# Altium schematic sheet 贴锁控制板201105.SchDoc
size A2
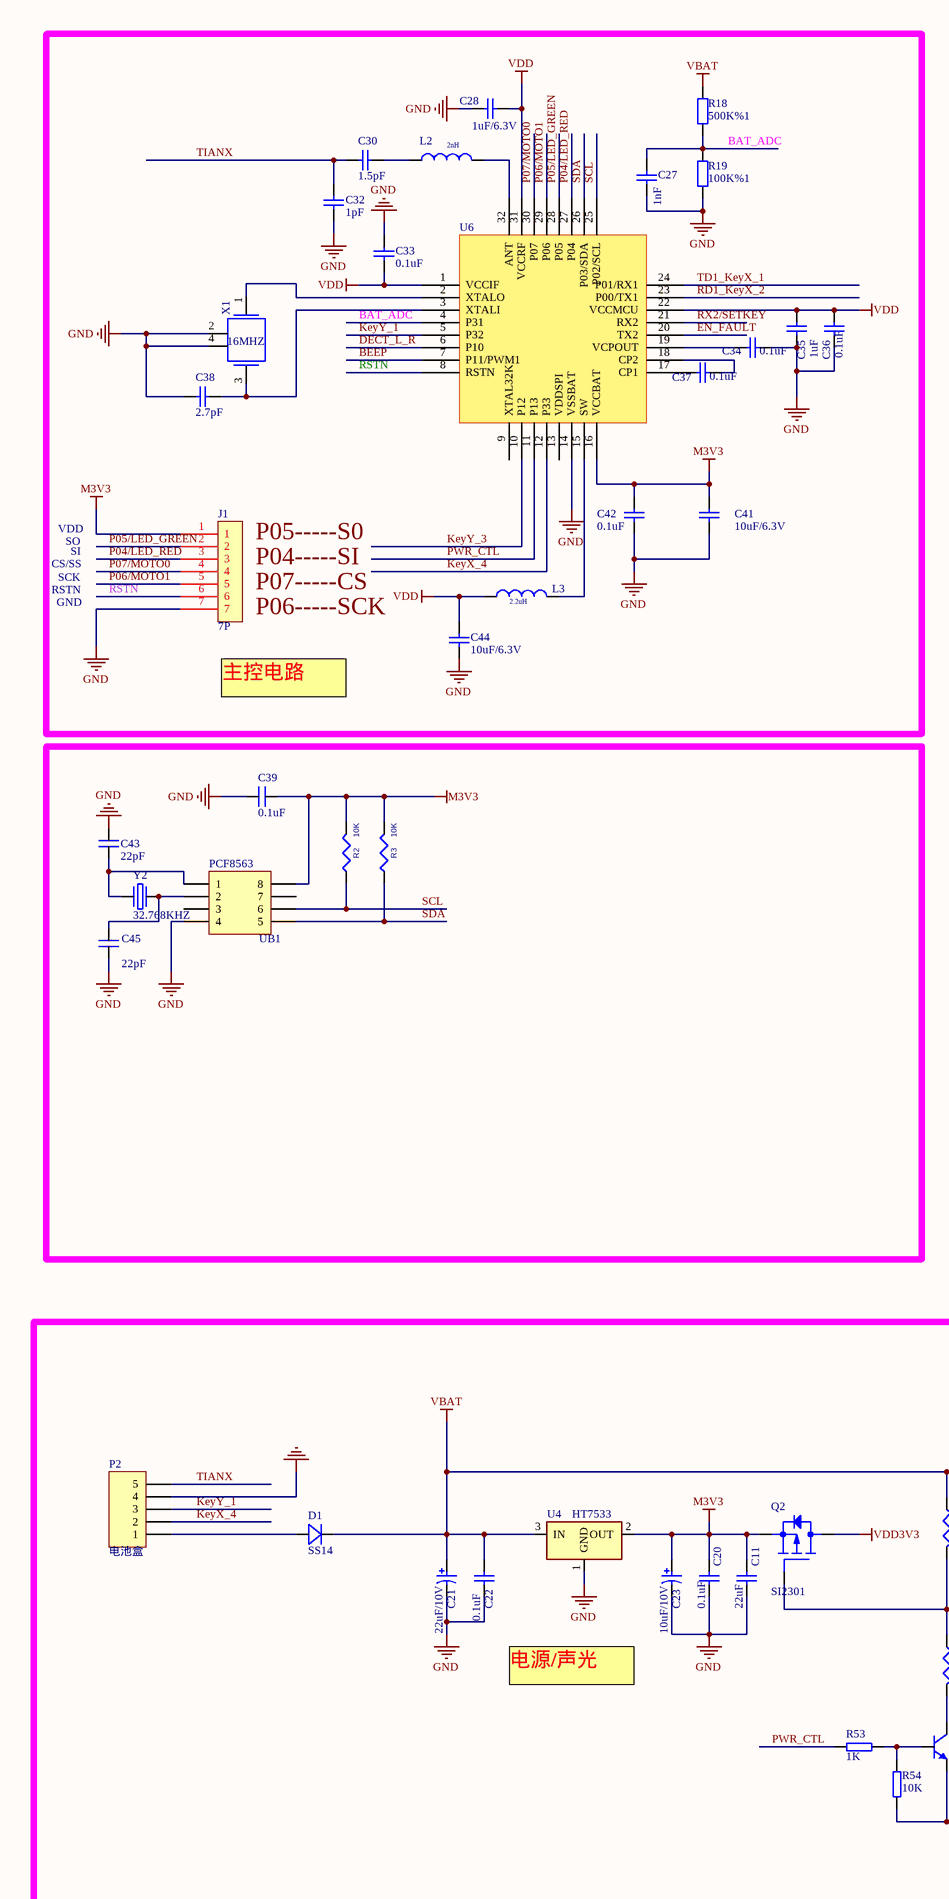
[diagram p0: 贴锁控制板201105.SchDoc, left]
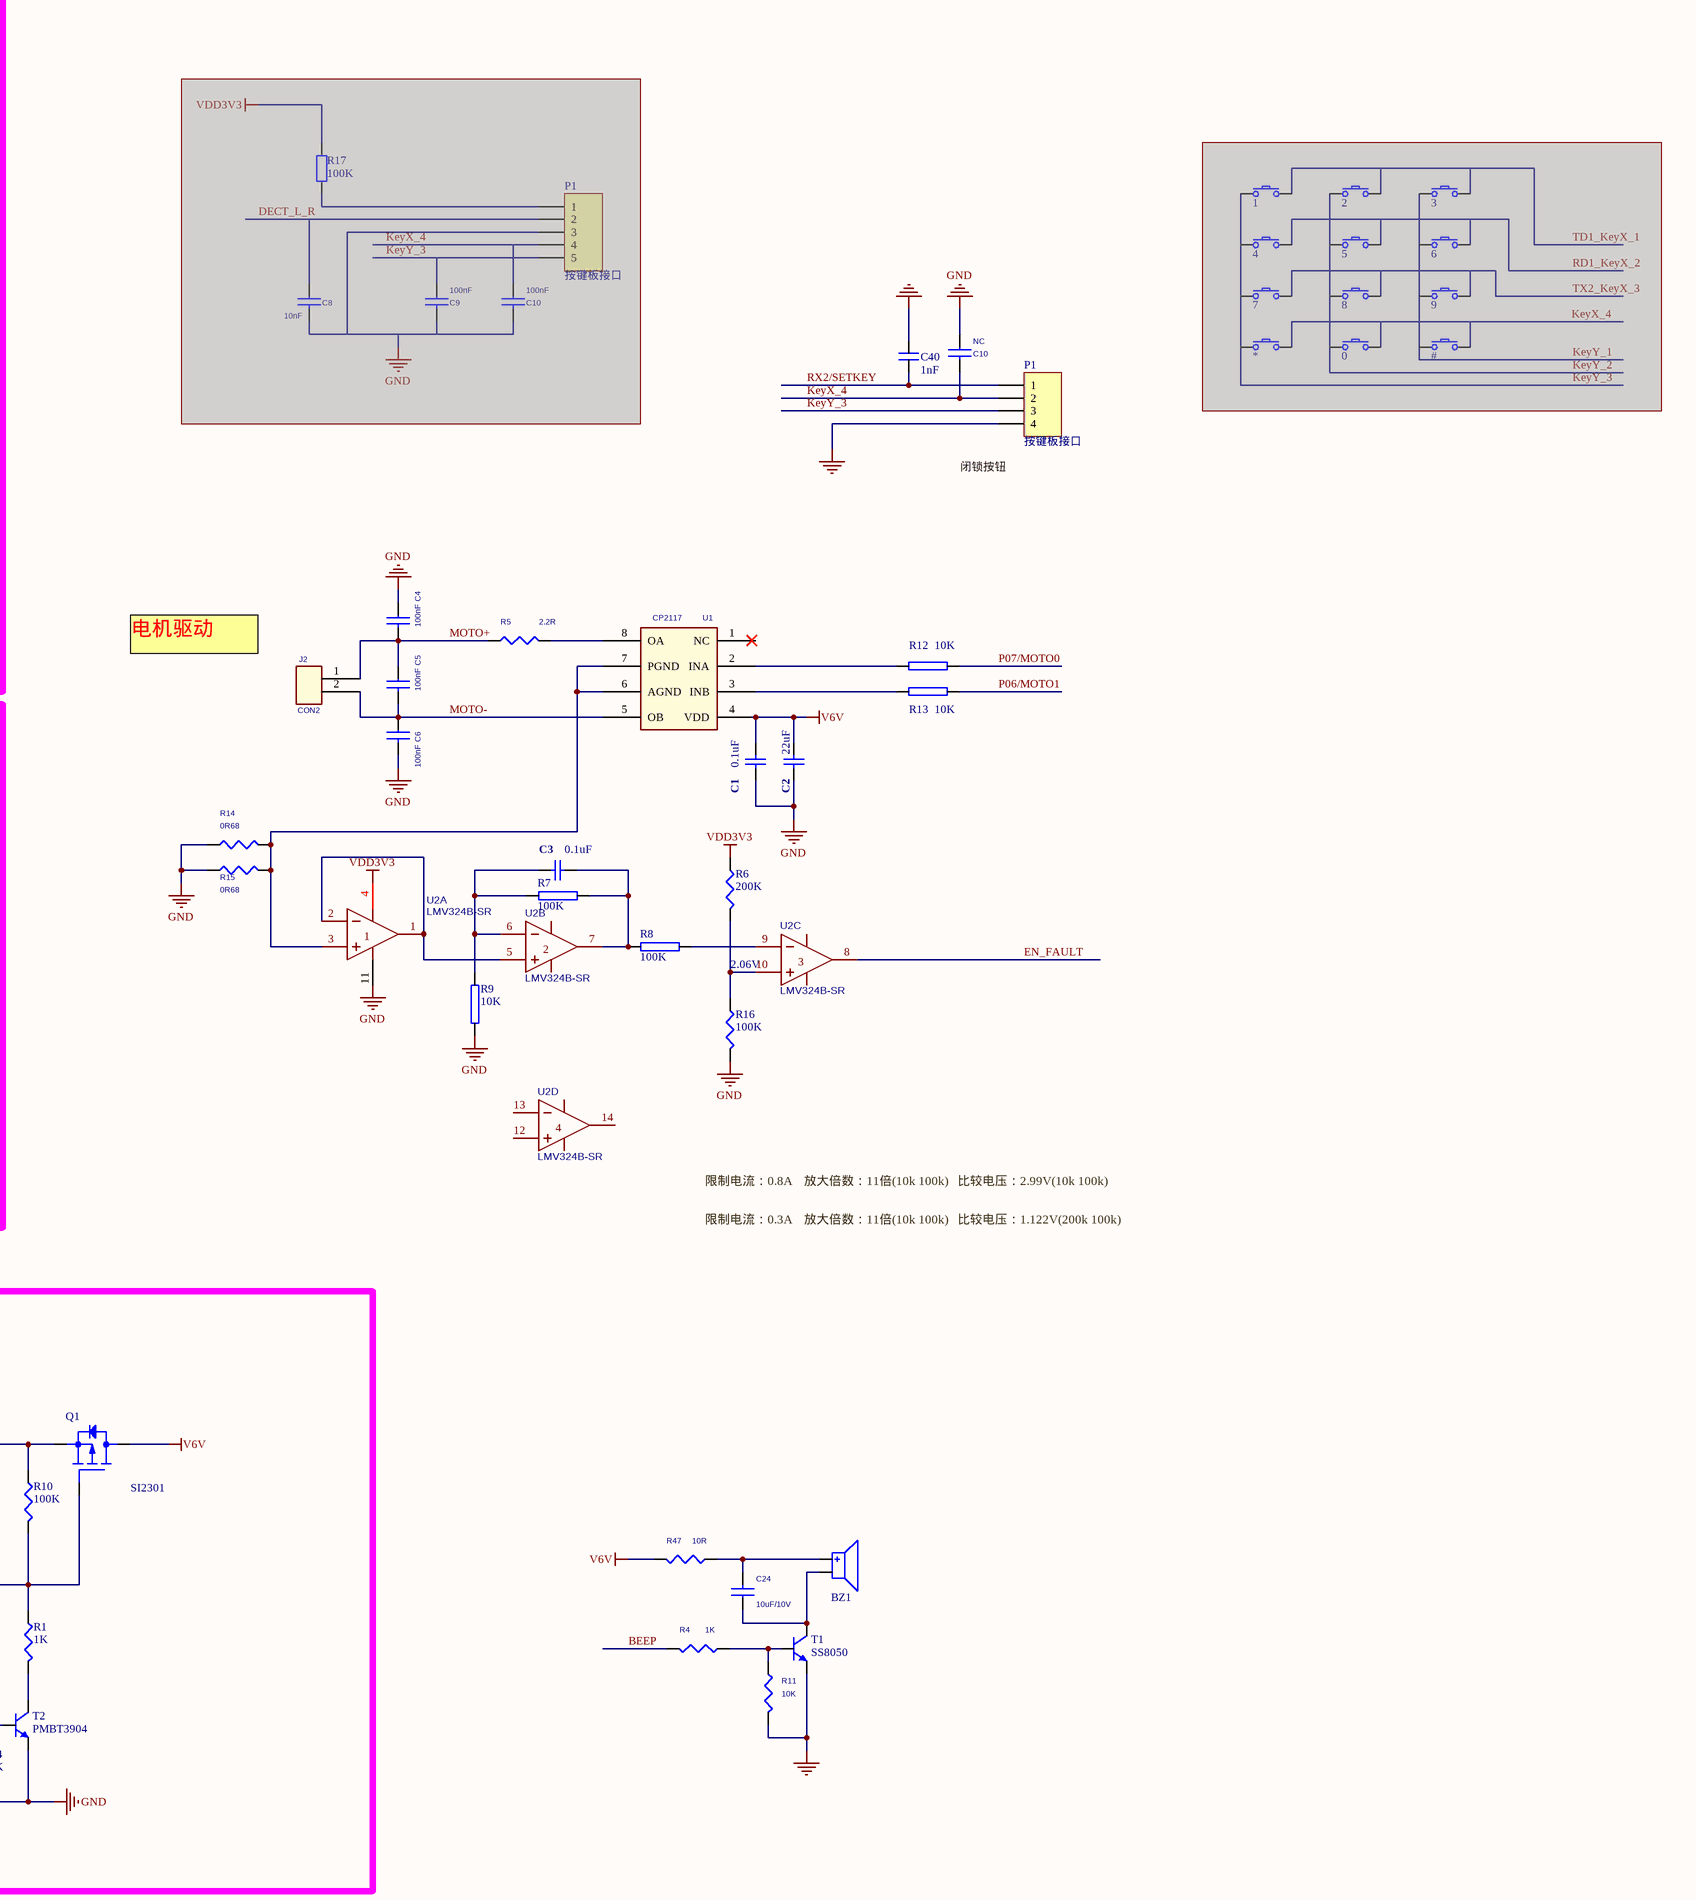
[diagram p1: 贴锁控制板201105.SchDoc, right]

## Parts
(Parts that share a designator on the sheet are numbered #1, #2 ... from top to bottom, then left to right.)
0  SW  [KEY_5.2*3.7*6.4]  (value not drawn)  (masked out: inside a compile mask, not in the netlist)
1  SW  [KEY_5.2*3.7*6.4]  (value not drawn)  (masked out: inside a compile mask, not in the netlist)
2  SW  [KEY_5.2*3.7*6.4]  (value not drawn)  (masked out: inside a compile mask, not in the netlist)
3  SW  [KEY_5.2*3.7*6.4]  (value not drawn)  (masked out: inside a compile mask, not in the netlist)
4  SW  [KEY_5.2*3.7*6.4]  (value not drawn)  (masked out: inside a compile mask, not in the netlist)
5  SW  [KEY_5.2*3.7*6.4]  (value not drawn)  (masked out: inside a compile mask, not in the netlist)
6  SW  [KEY_5.2*3.7*6.4]  (value not drawn)  (masked out: inside a compile mask, not in the netlist)
7  SW  [KEY_5.2*3.7*6.4]  (value not drawn)  (masked out: inside a compile mask, not in the netlist)
8  SW  [KEY_5.2*3.7*6.4]  (value not drawn)  (masked out: inside a compile mask, not in the netlist)
9  SW  [KEY_5.2*3.7*6.4]  (value not drawn)  (masked out: inside a compile mask, not in the netlist)
#  SW  [KEY_5.2*3.7*6.4]  (value not drawn)  (masked out: inside a compile mask, not in the netlist)
*  SW  [KEY_5.2*3.7*6.4]  (value not drawn)  (masked out: inside a compile mask, not in the netlist)
BZ1  BUZZER  [BUZZER_9*9*1.8]  (value not drawn)
C1  0.1uF  [0603C]
C2  22uF  [LC-0805_C]
C3  0.1uF  [0603C]
C4  100nF  [0603C]
C5  100nF  [0603C]
C6  100nF  [0603C]
C8  10nF  [0603C]  (masked out: inside a compile mask, not in the netlist)
C9  100nF  [0603C]  (masked out: inside a compile mask, not in the netlist)
C10#1  100nF  [0603C]  (masked out: inside a compile mask, not in the netlist)
C10#2  NC  [0603C]
C11  22uF  [LC-0805_C]
C20  0.1uF  [0603C]
C21  22uF/10V  [LC-0805_C]
C22  0.1uF  [0603C]
C23  10uF/10V  [LC-0805_C]
C24  10uF/10V  [0603C]
C27  1nF  [0603C]
C28  1uF/6.3V  [0603C]
C30  1.5pF  [0603C]
C32  1pF  [0603C]
C33  0.1uF  [0603C]
C34  0.1uF  [0603C]
C35  1uF  [0603C]
C36  0.1uF  [0603C]
C37  0.1uF  [0603C]
C38  2.7pF  [0603C]
C39  0.1uF  [0603C]
C40  1nF  [0603C]
C41  10uF/6.3V  [0603C]
C42  0.1uF  [0603C]
C43  22pF  [0603C]
C44  10uF/6.3V  [0603C]
C45  22pF  [0603C]
D1  SS14  [DO-214AA]
J1  7P  [7P-2.0MM - duplicate]
J2  CON2  [2PH-2.0]
L2  2nH  [0603L]
L3  2.2uH  [0603L]
P1#1  按键板接口  [TH_5P-P1.25]  (masked out: inside a compile mask, not in the netlist)
P1#2  按键板接口  [B4B-PH]
P2  电池盒  [B5B-PH]
Q1  SI2301  [SOT-23 - GDS]
Q2  SI2301  [SOT-23 - GDS]
R1  1K  [LC-0603_R]
R2  10K  [LC-0603_R]
R3  10K  [LC-0603_R]
R4  1K  [LC-0603_R]
R5  2.2R  [0805_R]
R6  200K  [LC-0603_R]
R7  100K  [LC-0603_R]
R8  100K  [LC-0603_R]
R9  10K  [LC-0603_R]
R10  100K  [LC-0603_R]
R11  10K  [LC-0603_R]
R12  10K  [LC-0603_R]
R13  10K  [LC-0603_R]
R14  0R68  [LC-0603_R]
R15  0R68  [LC-0603_R]
R16  100K  [LC-0603_R]
R17  100K  [LC-0603_R]  (masked out: inside a compile mask, not in the netlist)
R18  500K%1  [LC-0603_R]
R19  100K%1  [LC-0603_R]
R47  10R  [LC-0603_R]
R53  1K  [LC-0603_R]
R54  10K  [LC-0603_R]
T1  SS8050  [SOT-23-3L]
T2  PMBT3904  [SOT-23-3L]
U1  CP2117  [SOP8]
U2  LMV324B-SR  [SOIC-14_L8.7-W3.9-P1.27-LS6.0-BL]  (parts A,B,C,D of 4)
U4  HT7533  [SOT-23-3L]
U6  BK3431Q  [QFN32_4*4*0.4]  (value not drawn)
UB1  PCF8563  [SOP8]
X1  16MHZ  [XTAL3225]
Y2  32.768KHZ  [晶振-9]

## Nets
GND: C1.2 C2.2 C4.1 C6.2 C10#2.1 C11.2 C20.2 C21.2 C22.2 C23.2 C27.1 C28.1 C32.1 C33.1 C34.2 C35.1 C36.1 C38.1 C39.2 C40.2 C41.2 C42.2 C43.2 C44.1 C45.1 J1.7 P1#2.4 P2.4 R9.2 R11.2 R14.1 R15.1 R16.2 R19.2 R54.1 T1.2 T2.2 U2.11(-VS) U4.1(GND) U6.14(VSSBAT) UB1.4 X1.2 X1.4
M3V3: C11.1 C20.1 C23.1 C39.1 C41.1 C42.1 J1.1 Q2.S(SOURCE) R2.1 R3.1 U4.2(OUT) U6.16(VCCBAT) UB1.8
V6V: C1.1 C2.1 Q1.D(DRAIN) R47.2 U1.4(VDD)
VBAT: C21.1 C22.1 D1.2(K) Q1.S(SOURCE) R10.1 R18.1 U4.3(IN)
VDD: C28.2 C33.2 C35.2 C36.2 C44.2 L3.1(P1) U6.1(VCCIF) U6.22(VCCMCU) U6.31(VCCRF)
VDD3V3: Q2.D(DRAIN) R6.1 U2.4(+VS)
BAT_ADC: C27.2 R18.2 R19.1 U6.4(P31)
BEEP: R4.2 U6.7(P11/PWM1)
DECT_L_R: U6.6(P10)
EN_FAULT: U2.8(OUTC) U6.20(TX2)
KeyX_4: C10#2.2 P1#2.2 P2.2 U6.12(P33)
KeyY_1: P2.3 U6.5(P32)
KeyY_3: P1#2.3 U6.10(P12)
MOTO+: C4.2 C5.1 J2.1 R5.1
MOTO-: C5.2 C6.1 J2.2 U1.5(OB)
P04/LED_RED: J1.3 U6.27(P04)
P05/LED_GREEN: J1.2 U6.28(P05)
P06/MOTO1: J1.5 R13.1 U6.29(P06)
P07/MOTO0: J1.4 R12.1 U6.30(P07)
PWR_CTL: R53.1 U6.11(P13)
RD1_KeyX_2: U6.23(P00/TX1)
RSTN: J1.6 U6.8(RSTN)
RX2/SETKEY: C40.1 P1#2.1 U6.21(RX2)
SCL: R2.2 U6.25(P02/SCL) UB1.6
SDA: R3.2 U6.26(P03/SDA) UB1.5
TD1_KeyX_1: U6.24(P01/RX1)
TIANX: C30.2 C32.2 P2.5
NetBZ1_1: BZ1.1 C24.2 R47.1
NetBZ1_2: BZ1.2 C24.1 T1.3
NetC3_1: C3.1 R7.2 R9.1 U2.6(INB-)
NetC3_2: C3.2 R7.1 R8.1 U2.7(OUTB)
NetC30_1: C30.1 L2.1(P1)
NetC34_1: C34.1 U6.19(VCPOUT)
NetC37_1: C37.1 U6.17(CP1)
NetC37_2: C37.2 U6.18(CP2)
NetC38_2: C38.2 U6.3(XTALI) X1.3
NetC43_1: C43.1 UB1.1 Y2.1
NetC45_2: C45.2 UB1.2 Y2.2
NetD1_1: D1.1(A) P2.1
NetL2_2: L2.2(P2) U6.32(ANT)
NetL3_2: L3.2(P2) U6.15(SW)
NetQ1_G: Q1.G(GATE) Q2.G(GATE) R1.1 R10.2
NetR1_2: R1.2 T2.3
NetR4_1: R4.1 R11.1 T1.1
NetR5_2: R5.2 U1.8(OA)
NetR6_2: R6.2 R16.1 U2.10(INC+)
NetR8_2: R8.2 U2.9(INC-)
NetR12_2: R12.2 U1.2(INA)
NetR13_2: R13.2 U1.3(INB)
NetR14_2: R14.2 R15.2 U1.6(AGND) U1.7(PGND) U2.3(INA+)
NetR53_2: R53.2 R54.2 T2.1
NetU2_1: U2.1(OUTA) U2.2(INA-) U2.5(INB+)
NetU6_2: U6.2(XTALO) X1.1

Not connected (* = marked no-connect by the designer): U1 1(NC); U2 12(IND+) 13(IND-) 14(OUTD); U6 9(XTAL32K) 13(VDDSPI); UB1 3 7

## Notes on the sheet
- VDD
- 闭锁按钮
- RSTN
- CS/SS
- SCK
- SO
- SI
- (near J1) P04-----SI
- (near J1) P05-----S0
- (near J1) P07-----CS
- GND
- (near J1) P06-----SCK
- 主控电路
- 电机驱动
- (near U2) 2.06V
- 限制电流：0.8A    放大倍数：11倍(10k 100k)   比较电压：2.99V(10k 100k)
- 限制电流：0.3A    放大倍数：11倍(10k 100k)   比较电压：1.122V(200k 100k)
- 电源/声光

## Library data of the parts
0-9 # * = SW: Switch
C1-C3 C11 C20 C22 C27 = CAP-NP: Capacitor, Ceramic; Capacitance: 18 pF; Dielectric: COG; Polarity: Non-Polarized; Rated Voltage: 50 mV; Tolerance: 5 %; Category: Capacitor; Mounting Technology: Surface Mount; Status: Unreleased; Technology: Ceramic
C4-C6 C8 C9 C10#1 C10#2 = CAP NP
C21 C23 = CAP-P: Capacitor, tolerance ±20%
C24 = C_0_Dup1
C28 C30 C32-C38 C41 C42 C44 = Cap: Capacitor; Value: 10pF; Published: 8-Jun-2000; LatestRevisionDate: 17-Jul-2002; LatestRevisionNote: Re-released for DXP Platform.; PackageReference: RAD-0.3; Publisher: Altium Limited; PackageDescription: Radial Cap, Thru-Hole; 2 Leads; 0.3 in Pin Spacing
C39 C40 C43 C45 = C
D1 = D
L2 L3 = INDUCTOR: Power Inductor, 4.7uH, 0.7A, 260mR DCR; XMOS Part Number: E-09-0011; Manufacturer: Taiyo Yuden; Manufacturer Part Number: CBC2518T4R7M; Part Creator: JG; LEVEL: STD; DEVICE: L; FORWARD_PCB: 1; Tolerance (%): 20; Max DC Resistance: 0.26R; Rated Current (Saturation): 0.68A; Rated Current (Temp Rise): 0.92A; Approx Volume Cost ($): 0.07; Approved: NO; VALUE: 2.0nH; Datasheet: http://www.yuden.co.jp/us/product/pdf/ecb2_e.pdf; Max Height (mm): 2; Digikey Link: http://search.digikey.com/scripts/DkSearch/dksus.dll?lang=en&site=US&keywords=CBC2518T4R7M
P1#1 P2 = Header 5: Header, 5-Pin; LatestRevisionDate: 17-Jul-2002; LatestRevisionNote: Re-released for DXP Platform.; Publisher: Altium Limited
P1#2 = Header 4_1: Header, 4-Pin; LatestRevisionDate: 17-Jul-2002; LatestRevisionNote: Re-released for DXP Platform.; Publisher: Altium Limited
Q1 Q2 = PWRMOSFET_EP_DGS_0
R1 R6 R10 R16 R53 R54 = R
R2 R3 = RES
R4 R5 R11 R14 R15 R47 = R_Dup1
R7-R9 R12 R13 = Pro71C3.TMP_UnNamed_1
R17 = Res2: Resistor; Value: 1K; Published: 2013年12月24日; LatestRevisionDate: 2013年12月24日; LatestRevisionNote: Re-released for DXP Platform.
R18 R19 = Res2: Resistor; Value: 470K; Published: 2013年12月24日; LatestRevisionDate: 2013年12月24日; LatestRevisionNote: Re-released for DXP Platform.
T1 T2 = NPN_BJT: Bipolar Junction Transistor
U1 = AM24LC02_0
U2 = LMV324B-SR: BOM_Manufacturer: 3PEAK; subpart_no: 1; BOM_Supplier: LCSC; BOM_Supplier Part: C248570; BOM_Manufacturer Part: LMV324B-SR; spicePre: U; spiceSymbolName: LMV324B-SR
U4 = XC6206P302M
UB1 = IC8
X1 = OSC: XMOS Part Number: E-07-0030; Manufacturer: Abracon; Manufacturer Part Number: ABLS-24.000MHz-B4; Part Creator: JG; LEVEL: STD; DEVICE: X; FORWARD_PCB: 1; Approx Volume Cost ($): 0.15; Approved: NO; VALUE: ABLS; FREQUENCY: 38.4MHZ; Datasheet: http://www.abracon.com/Resonators/abls.pdf; Max Height (mm): 4.2; Supplier Link: http://search.digikey.com/scripts/DkSearch/dksus.dll?lang=en&site=US&keywords=ABLS-24.000MHz-B4
Y2 = 晶振